# Altium schematic sheet DB10005_PowerSwitch.SchDoc: Power switching
size A3; SheetNumber: 5; SheetTotal: 7
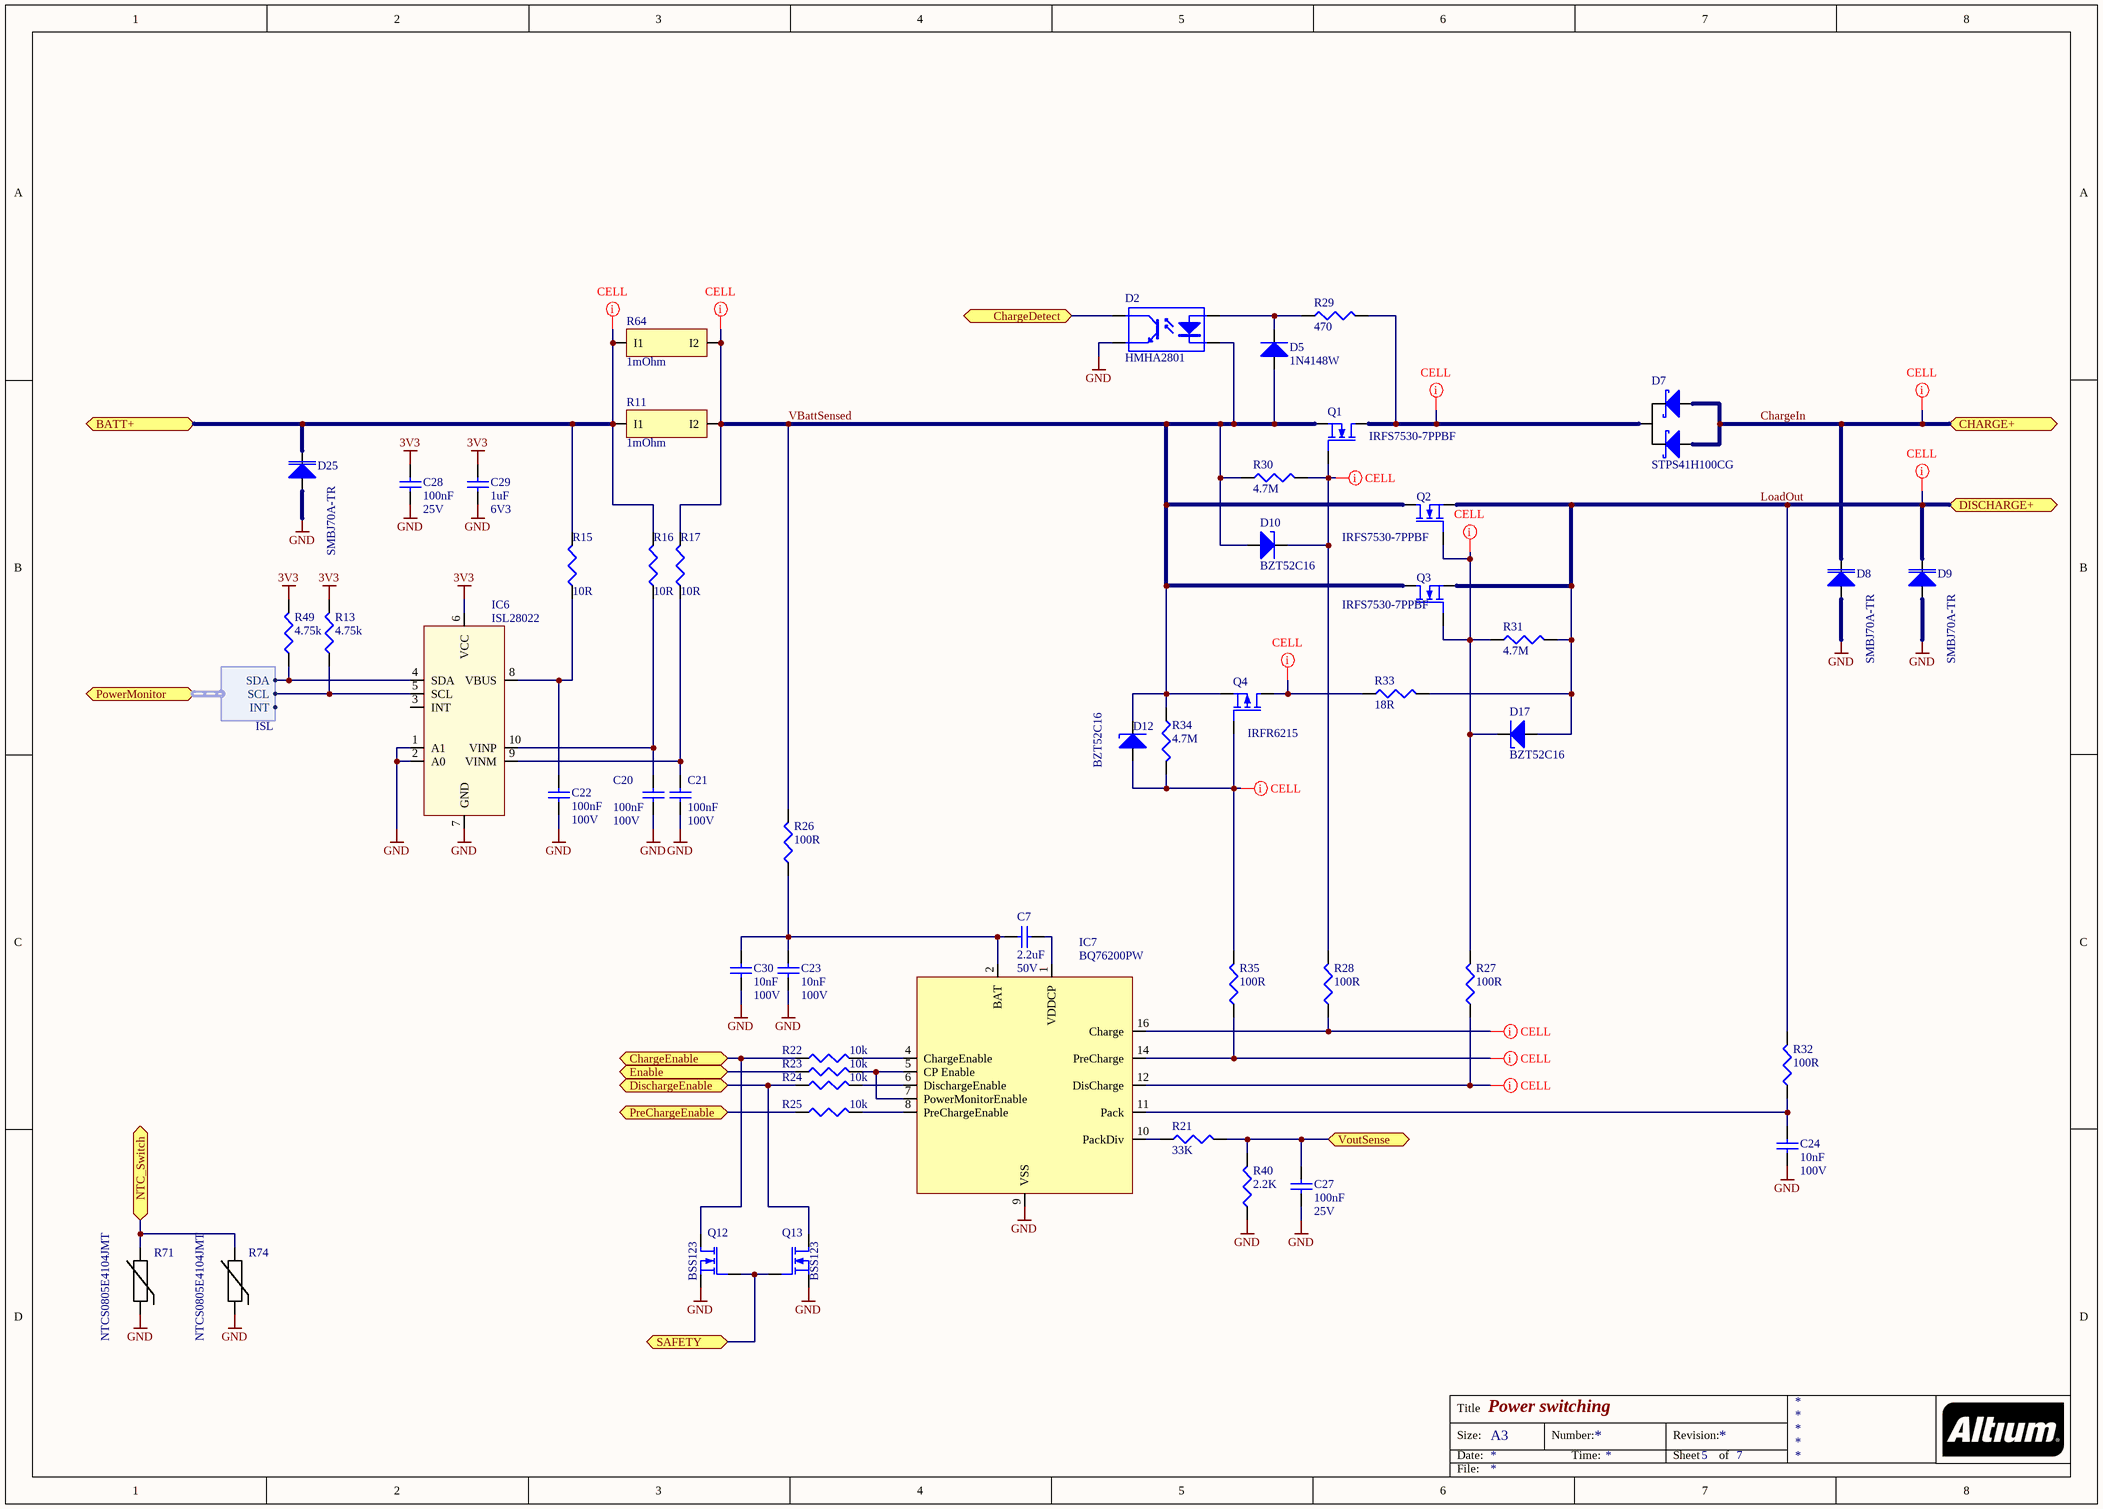
[diagram p0: DB10005_PowerSwitch.SchDoc]

## Parts
C7  2.2uF  Voltage Rating: 50V  [C-0805]
C20  100nF  Voltage Rating: 100V  [C-0805]
C21  100nF  Voltage Rating: 100V  [C-0805]
C22  100nF  Voltage Rating: 100V  [C-0805]
C23  10nF  Voltage Rating: 100V  [C-0805]
C24  10nF  Voltage Rating: 100V  [C-0805]
C27  100nF  Voltage Rating: 25V  [C0402]
C28  100nF  Voltage Rating: 25V  [C0402]
C29  1uF  Voltage Rating: 6V3  [C0402]
C30  10nF  Voltage Rating: 100V  [C-0805]
D2  HMHA2801  [FSOP4]
D5  1N4148W  [SOD123]
D7  STPS41H100CG  [D2-PAK]
D8  SMBJ70A-TR  [SMB]
D9  SMBJ70A-TR  [SMB]
D10  BZT52C16  [SOD123]
D12  BZT52C16  [SOD123]
D17  BZT52C16  [SOD123]
D25  SMBJ70A-TR  [SMB]
IC6  ISL28022  [MSOP10]
IC7  BQ76200PW  [TSSOP16]
Q1  IRFS7530-7PPBF  [D2PAK7]
Q2  IRFS7530-7PPBF  [D2PAK7]
Q3  IRFS7530-7PPBF  [D2PAK7]
Q4  IRFR6215  [D-PAK]
Q12  BSS123  [SOT-23]
Q13  BSS123  [SOT-23]
R11  1mOhm  [FCSL110]
R13  4.75k  [0402]
R15  10R  [0603]
R16  10R  [0603]
R17  10R  [0603]
R21  33K  [0603]
R22  10k  [0402]
R23  10k  [0402]
R24  10k  [0402]
R25  10k  [0402]
R26  100R  [0603]
R27  100R  [0805]
R28  100R  [0805]
R29  470  [0402]
R30  4.7M  [0805]
R31  4.7M  [0805]
R32  100R  [0603]
R33  18R  [SM_3]
R34  4.7M  [0805]
R35  100R  [0805]
R40  2.2K  [0603]
R49  4.75k  [0402]
R64  1mOhm  [FCSL110]
R71  NTCS0805E4104JMT  [0805]
R74  NTCS0805E4104JMT  [0805]

## Ports
BATT+, CHARGE+, ChargeDetect, ChargeEnable, DISCHARGE+, DischargeEnable, Enable, NTC_Switch, PowerMonitor (harness ISL), PreChargeEnable, SAFETY, VoutSense

## Harnesses
ISL: SDA, SCL, INT

## Nets
3V3: C28.2 C29.2 IC6.6(VCC) R13.2 R49.2
GND: C20.1 C21.1 C22.1 C23.1 C24.1 C27.1 C28.1 C29.1 C30.1 D2.3(E1) D8.1 D9.1 D25.1 IC6.1(A1) IC6.2(A0) IC6.7(GND) IC7.9(VSS) Q12.S Q13.S R40.1 R71.1 R74.1
BATT+: D25.2 R11.0(I1) R15.2 R16.2 R64.0(I1) ; port BATT+
ChargeDetect: D2.4(C1) ; port ChargeDetect
ChargeEnable: Q12.D R22.1 ; port ChargeEnable
ChargeIn: D7.A1 D7.A2 D8.2 ; port CHARGE+
DischargeEnable: Q13.D R24.1 ; port DischargeEnable
Enable: R23.1 ; port Enable
LoadOut: D9.2 D17.1(A) Q2.S Q3.S R31.2 R32.2 R33.2 ; port DISCHARGE+
NTC_Switch: R71.2 R74.2 ; port NTC_Switch
PreChargeEnable: R25.1 ; port PreChargeEnable
SAFETY: Q12.G Q13.G ; port SAFETY
VBattSensed: D2.2(K1) D5.1(A) D10.1(A) D12.2(K) Q1.S Q2.D Q3.D Q4.S R11.1(I2) R17.2 R26.2 R30.1 R34.1 R64.1(I2)
VoutSense: C27.2 R21.2 R40.2 ; port VoutSense
NetC7_1: C7.1 C23.2 C30.2 IC7.2(BAT) R26.1
NetC7_2: C7.2 IC7.1(VDDCP)
NetC20_2: C20.2 IC6.10(VINP) R16.1
NetC21_2: C21.2 IC6.9(VINM) R17.1
NetC22_2: C22.2 IC6.8(VBUS) R15.1
NetC24_2: C24.2 IC7.11(Pack) R32.1
NetD2_1: D2.1(A1) D5.2(K) R29.1
NetD7_K: D7.K Q1.D R29.2
NetD10_2: D10.2(K) Q1.G R28.2 R30.2
NetD12_1: D12.1(A) Q4.G R34.2 R35.2
NetD17_2: D17.2(K) Q2.G Q3.G R27.2 R31.1
NetIC6_4: IC6.4(SDA) R49.1 ; port PowerMonitor.SDA
NetIC6_5: IC6.5(SCL) R13.1 ; port PowerMonitor.SCL
NetIC7_4: IC7.4(ChargeEnable) R22.2
NetIC7_5: IC7.5(CP_Enable) IC7.7(PowerMonitorEnable) R23.2
NetIC7_6: IC7.6(DischargeEnable) R24.2
NetIC7_8: IC7.8(PreChargeEnable) R25.2
NetIC7_10: IC7.10(PackDiv) R21.1
NetIC7_12: IC7.12(DisCharge) R27.1
NetIC7_14: IC7.14(PreCharge) R35.1
NetIC7_16: IC7.16(Charge) R28.1
NetQ4_D: Q4.D R33.1

Not connected (* = marked no-connect by the designer): IC6 3(INT)

## Layout directives
net class CELL: BATT+, ChargeIn, LoadOut, NetD7_K, NetD10_2, NetD12_1, NetD17_2, NetIC7_12, NetIC7_14, NetIC7_16, NetQ4_D, VBattSensed

## Notes on the sheet
- Title
- Size:
- Date:
- A3
- Number:
- Time:
- Revision:
- Sheet
- of
- File:

## Library data of the parts
C7 = 2.2uF/0805/CER/50V: Capacitor, 2.2uF, 50V,  X7R; Dielectric Characteristic: X5R; Capacitance Tolerance: ± 10%; Capacitor Case Style: 0805; Brand Number: GRM219R61H225KE15D; Brand: MURATA; Capacitance: 2.2uF; Temperature Range: -55°C to +125°C; Price: 0,113; Order Code Supplier: 2611933; Supplier: Farnell
C20-C22 = 100nF/0805/CER/100V: Capacitor, 100nF, 100V, X7R; Capacitance Tolerance: ± 10%; Capacitor Case Style: 0805; Brand Number: C0805C104K1RACTU; Brand: KEMET; Dielectric Characteristic: X7R; Capacitance: 100nF; Temperature Range: -55°C to +125°C; Price: 0,096; Order Code Supplier: 1650862; Supplier: Farnell
C23 C24 C30 = 10nF/0805/CER/100V: Capacitor, 10nF, 100V, X7R; Capacitance Tolerance: ± 10%; Capacitor Case Style: 0805; Brand Number: 08051C103KAZ2A; Brand: AVX; Dielectric Characteristic: X7R; Capacitance: 10nF; Temperature Range: -55°C to +125°C; Price: 0,131; Order Code Supplier: 1301898; Supplier: Farnell
C27 C28 = 100nF/0402/CER/25V: Capacitor, 100nF, 25V, X7R; Capacitance Tolerance: 10nF; Capacitor Case Style: 0402; Brand Number: GRM155R71E104KE14D; Brand: MULTICOMP; Dielectric Characteristic: X7R; Capacitance: 100nF; Temperature Range: -55 to +125 C; Price: 0,0225; Order Code Supplier: 2456106; Supplier: Farnell
C29 = 1uF/0402/CER/6.3V: Capacitor, 1uF, 6.3V, X5R; Capacitance Tolerance: ± 10%; Capacitor Case Style: 0402; Brand Number: 04026D105KAT2A; Brand: AVX; Dielectric Characteristic: X5R; Capacitance: 1uF; Temperature Range: -55°C to +85°C; Price: 0,0874; Order Code Supplier: 1327658; Supplier: Farnell
D2 = HMHA2801: Optocoupler, Vout:80V, Iin:0.01A; Brand: FAIRCHILD SEMICONDUCTOR; Isolation Voltage: 2500V; Input Current: 0.01A; Output Voltage: 80V; Brand Number: HMHA2801; Case Style: *; Price: 0,28; Order Code Supplier: 1652504; Supplier: Farnell; Temperature Range: -55°C to +100°C
D5 = MMSD4148T1G: Diode, Vrrm: 100V, If: 0.15A, Vf: 1V; Brand: ON SEMICONDUCTOR; Case Style: SOD-123; Forward Current: 0.2A; Brand Number: MMSD4148T1G; Forward Voltage: 1V; Order Code Supplier: 9556079; Price: 0,19; Supplier: Farnell; Temperature Range: -65°C to +150°C; Vrrm: 100V
D7 = STPS41H100CG: 100 V, 40 A, TO-263, 3 Pins, 900 mV; Brand: ST. Micro; Brand Number: STPS41H100CG-TR; Forward Current: 2 * 20A; Forward Voltage: 0.9V; Vrrm: 100V; Case Style: TO-263; Order Code Supplier: 2353681; Price: 1,53; Supplier: Farnell; Temperature Range: -55°C to +125°C
D8 D9 D25 = SMBJ70A-TR: Diode TVS, Vrwm: 70V, Vbr: 81.9V, Vc: 113V, Ippm: 27A; Brand: STMICROELECTRONICS; Brand Number: SMBJ70A-TR; Breakdown Voltage: 81.9V; Case Style: SMB; Clamping Voltage: 113V; Ippm: 27A; Order Code Supplier: 9886389; Price: 0,33; Supplier: Farnell; Temperature Range: -55°C to +150°C; Vrwm: 70V
D10 D12 D17 = BZT52C16: Diode Zener, Vz: 16V, If: 0.1A, Vf: 0.9V; Brand: Diodes; Case Style: SOD-123; Brand Number: BZT52C16; Forward Current: 0.1A; Forward Voltage: 0.9V; Order Code Supplier: 1902431; Price: 0,087; Supplier: Farnell; Temperature Range: -65°C to +150°C; Zener Voltage: 16V
IC6 = ISL28022: Current and voltage ADC; Brand Number: ISL28022FUZ; Brand: Intersil; Supplier: Farnell; Case Style: MSOP10; Price: 3,44; Order Code Supplier: 2373594
IC7 = BQ76200PW: Battery protector, Lead Acid; Brand: Texas Instruments; Brand Number: BQ76200PW; Case Style: TSSOP16; Order Code Supplier: 2522565; Price: 4,84; Supplier: Farnell; Temperature Range: -55°C to +155°C
Q1-Q3 = IRFS7530-7PPBF: Mosfet, N-channel, Vds:60V, Id:338A, Vgs-th:3.7V, Rds-on:0.00115ohm; Brand: INTERNATIONAL RECTIFIER; Case Style: TO-263; Drain Current: 338A; Drain Source Voltage: 60V; Gate Source Voltage: 10V; Threshold Voltage: 3.7V; Brand Number: IRFS7530-7PPBF; On Resistance: 0.00115ohm; Order Code Supplier: 2580027; Price: 4,40; Supplier: Farnell; Temperature Range: -55°C to +175°C; Transistor Polarity: N-Channel
Q4 = IRFR6215TRPBF: Mosfet, P-channel, Vds:150V, Id:13A, Vgs-th:4V, Rds-on:0.295ohm; Brand: INTERNATIONAL RECTIFIER; Brand Number: IRFR6215PBF; Drain Current: 13A; Drain Source Voltage: 150V; Gate Source Voltage: 20V; Threshold Voltage: 4; Case Style: D-PAK; On Resistance: 0.295ohm; Order Code Supplier: 1839002; Price: 0,94; Supplier: Farnell; Temperature Range: -55°C to +175°C; Transistor Polarity: P-channel
Q12 Q13 = BSS123: Mosfet, N-channel, Vds:100V, Id:0.15A, Vgs-th:2.8V, Rds-on:3.5ohm; Brand: NXP; Drain Current: 0.15A; Drain Source Voltage: 100V; Gate Source Voltage: 20V; On Resistance: 3.5ohm; Threshold Voltage: 2.8V; Brand Number: BSS123; Case Style: SOT-23; Order Code Supplier: 1510764; Price: 0,082; Supplier: Farnell; Temperature Range: -55°C to +150°C; Transistor Polarity: N-channel
R11 R64 = FCSL110R001JER: 1mohm, 5 W, ± 5%, 4320 Wide; Brand: Ohmite; Order Code Supplier: 2420535; Price: 3,81; Brand Number: FCSL110R001JER; Supplier: Farnell
R13 R49 = 4.75k/0402/0063W/50V: Resistor, 4.75k, 0.1%, 0.0625W, 50V, 100PPM, 0402; Brand: VISHAY DRALORIC; Brand Number: CRCW04024K75FKED; Power Rating: 0.063W; Case Style: 0402; Order Code Supplier: 2121689; Price: 0,0006; Resistance: 4.75k; Supplier: Farnell; Temperature Coefficient: ± 100PPM; Temperature Range: -55°C to +125°C; Voltage Rating: 50V
R15-R17 = 10/0603/0063W/50V: Resistor, 10R, 1%, 0.063W, 50V, 200PPM, 0603; Brand: VISHAY DRALORIC; Brand Number: CRCW060310R0FKEA; Case Style: 0603; Order Code Supplier: 2122113; Power Rating: 0.063W; Price: 0,038; Resistance: 10R; Supplier: Farnell; Temperature Coefficient: ± 200PPM; Temperature Range: -55°C to +125°C; Voltage Rating: 50V
R21 = 33K/0603/0063W/50V: Resistor, 33K, 1%, 0.063W, 50V, 100PPM, 0603; Brand: VISHAY DRALORIC; Brand Number: CRCW060333K0FKEA; Case Style: 0603; Order Code Supplier: 2122555; Power Rating: 0.063W; Price: 0,038; Resistance: 33K; Supplier: Farnell; Temperature Coefficient: ± 100PPM; Temperature Range: -55°C to +125°C; Voltage Rating: 50V
R22-R25 = 10k/0402/0063W/50V: Resistor, 10k, 0.1%, 0.0625W, 50V, 100PPM, 0402; Brand: VISHAY DRALORIC; Brand Number: CRCW040210K0FKED; Power Rating: 0.063W; Case Style: 0402; Order Code Supplier: 2121730; Price: 0,0005; Resistance: 10k; Supplier: Farnell; Temperature Coefficient: ± 100PPM; Temperature Range: -55°C to +125°C; Voltage Rating: 50V
R26 R32 = 100/0603/0063W/50V: Resistor, 100R, 1%, 0.063W, 50V, 200PPM, 0603; Brand: VISHAY DRALORIC; Brand Number: CRCW0603100RFKEA; Case Style: 0603; Order Code Supplier: 2122239; Power Rating: 0.063W; Price: 0,007; Resistance: 100R; Supplier: Farnell; Temperature Coefficient: ± 200PPM; Temperature Range: -55°C to +125°C; Voltage Rating: 50V
R27 R28 R35 = 100/0805/0250W/150V: Resistor, 100R, 1%, 0.25W, 150V, 100PPM, 0805; Brand: MULTICOMP; Brand Number: MCHP05W4F1000T5E; Case Style: 0805; Order Code Supplier: 1576445; Power Rating: 0.25W; Price: 0,089; Resistance: 100R; Supplier: Farnell; Temperature Coefficient: ± 100PPM; Temperature Range: -55°C to +155°C; Voltage Rating: 150V
R29 = 470/0402/0063W/50V: Resistor, 470, 1%, 0.0625W, 50V, 100PPM, 0402; Brand: VISHAY DRALORIC; Brand Number: CRG0402F470R; Power Rating: 0.063W; Case Style: 0402; Order Code Supplier: 2331533; Price: 0,0099; Resistance: 470; Supplier: Farnell; Temperature Coefficient: ± 100PPM; Temperature Range: -55°C to +125°C; Voltage Rating: 50V
R30 R31 R34 = 4.7M/0805/0250W/150V: Resistor, 4.7M, 1%, 0.25W, 150V, 100PPM, 0805; Brand: MULTICOMP; Brand Number: MCHP05W4F4704T5E; Case Style: 0805; Order Code Supplier: 1576516; Power Rating: 0.25W; Price: 0,089; Resistance: 4.7M; Supplier: Farnell; Temperature Coefficient: ± 100PPM; Temperature Range: -55°C to +155°C; Voltage Rating: 150V
R33 = 18: Resistor Wirewound, 18R, 5%, 3W, 500V, 200PPM, SMW; Brand: TE CONNECTIVITY / CGS; Brand Number: SMW318RJT; Case Style: SMW; Order Code Supplier: 1086385; Power Rating: 3W; Price: 0,80; Resistance: 18R; Supplier: Farnell; Temperature Coefficient: ± 200PPM; Temperature Range: -55°C to +200°C; Voltage Rating: 500V
R40 = 2.2K/0603/0063W/50V: Resistor, 2.2K, 1%, 0.063W, 50V, 100PPM, 0603; Brand: VISHAY DRALORIC; Brand Number: CRCW06032K20FKEA; Case Style: 0603; Order Code Supplier: 2122405; Power Rating: 0.063W; Price: 0,038; Resistance: 2.2K; Supplier: Farnell; Temperature Coefficient: ± 100PPM; Temperature Range: -55°C to +125°C; Voltage Rating: 50V
R71 R74 = NTCS0805E4104JMT: THERMISTOR, NTC, 100K, 5%; Brand: VISHAY; Supplier: Farnell; Case Style: 0805; Price: 0,65; Order Code Supplier: 1187095; Brand Number: NTCS0805E4104JMT